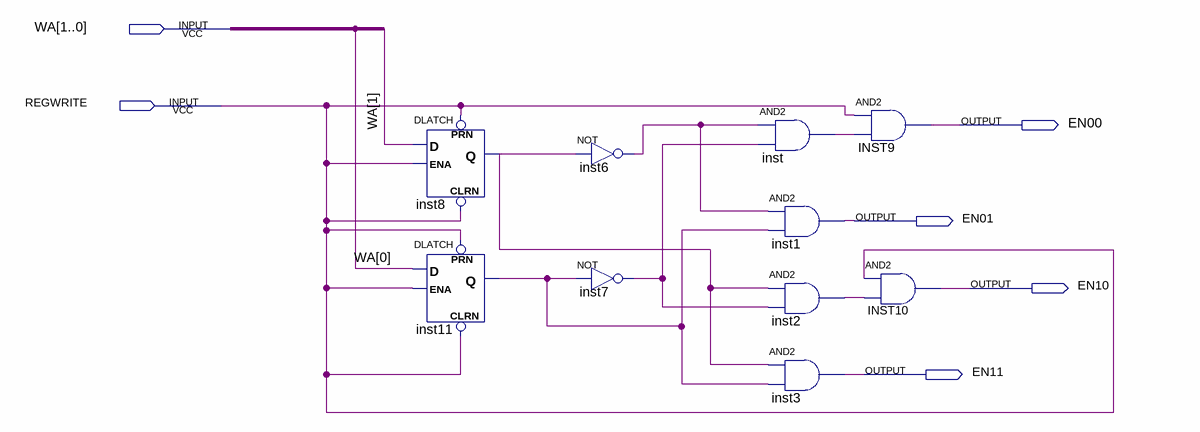
[diagram p0: schematic sheet]
// Quartus schematic dcdrCLKfree.bdf as structural Verilog: 10 symbols, 6 pins
module dcdrCLKfree (
  input  [1:0] WA,
  input  REGWRITE,
  output EN00,
  output EN01,
  output EN10,
  output EN11
);

  wire inst2_out, inst6_out, inst7_out, inst8_q, inst11_q, inst_out;

  DLATCH inst8 (.CLRN(REGWRITE), .D(WA[1]), .ENA(REGWRITE), .PRN(REGWRITE), .Q(inst8_q));
  DLATCH inst11 (.CLRN(REGWRITE), .D(WA[0]), .ENA(REGWRITE), .PRN(REGWRITE), .Q(inst11_q));
  not inst6 (inst6_out, inst8_q);
  not inst7 (inst7_out, inst11_q);
  and inst (inst_out, inst6_out, inst7_out);
  and inst1 (EN01, inst6_out, inst11_q);
  and inst2 (inst2_out, inst8_q, inst7_out);
  and inst3 (EN11, inst8_q, inst11_q);
  and INST9 (EN00, REGWRITE, inst_out);
  and INST10 (EN10, REGWRITE, inst2_out);
endmodule
